# Altium schematic sheet Sch0.SchDoc
size 420 x 297 mm; Address1: Address1; Address2: Address2; Address3: Address3; Address4: Address4; DocumentNumber: ADHF20_DT; SheetNumber: 1; Scale: 1:1; DocumentType: Схема электрическая принципиальная; FirstReferrence: ADHF20_DT
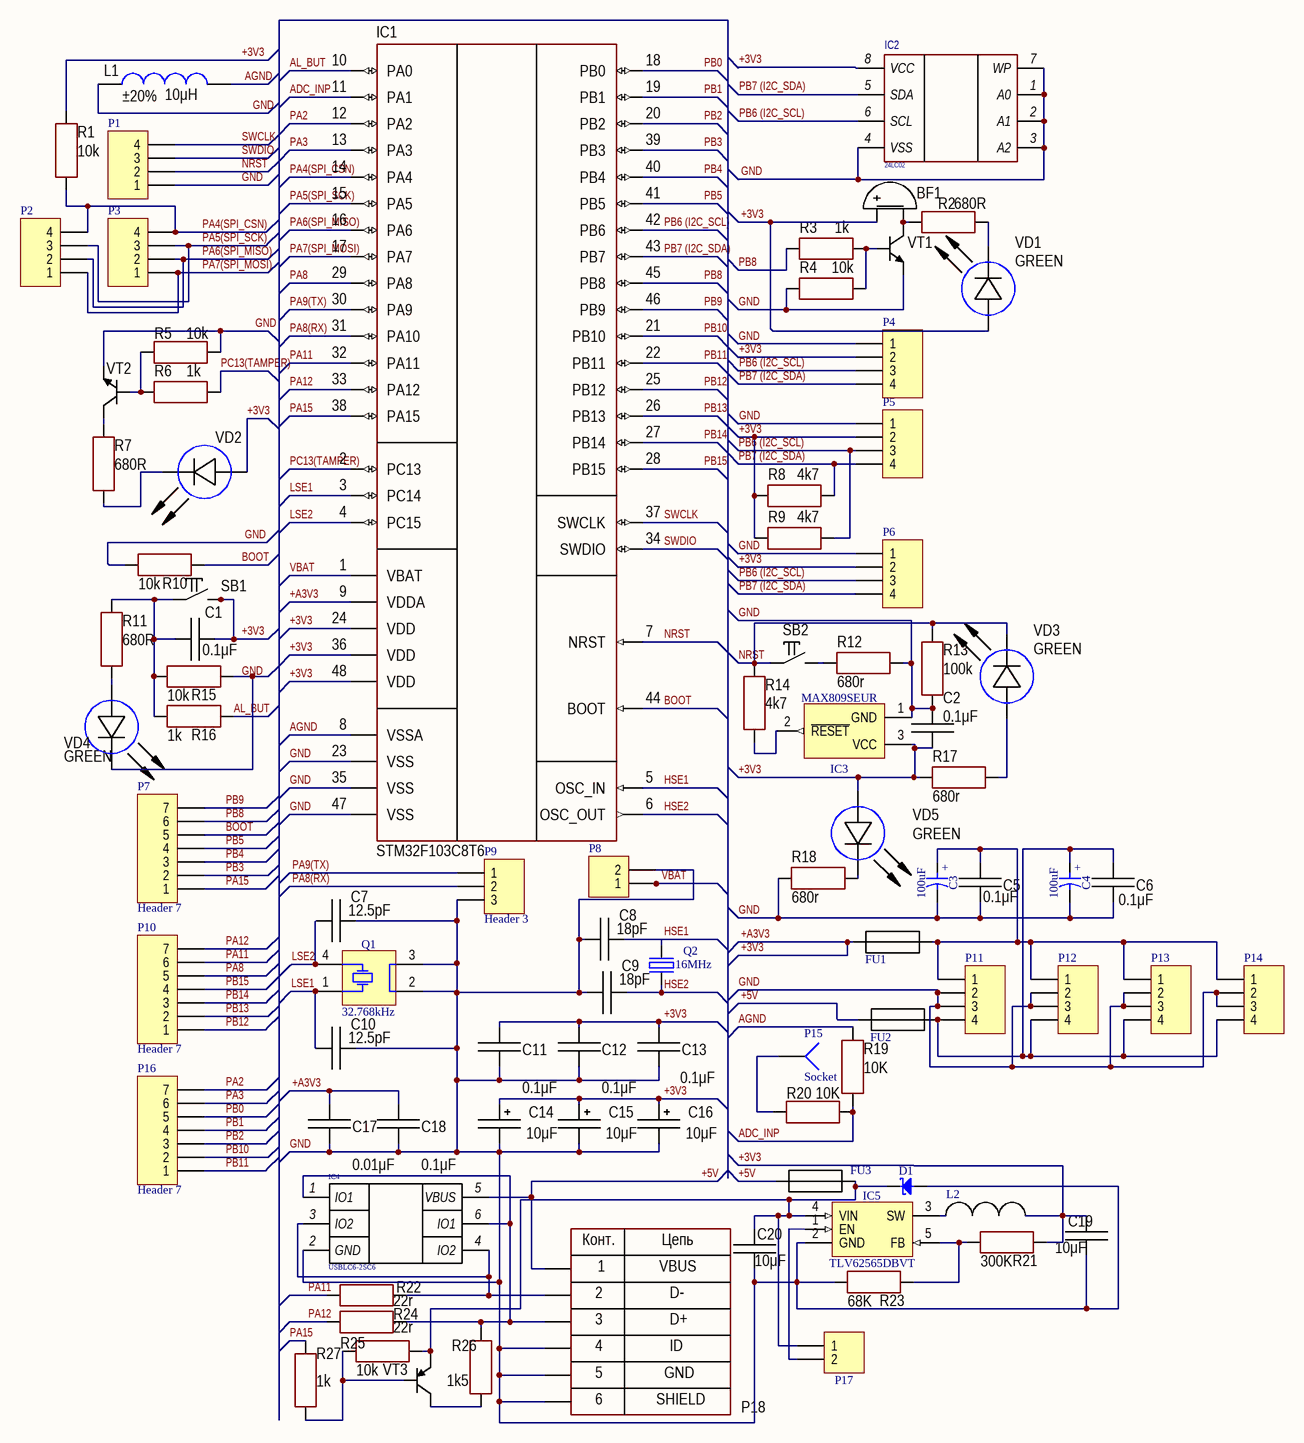
[diagram p0: Sch0.SchDoc]

## Parts
BF1  (no value)  [BUZ: AT-0927-TT-6-R]
C1  value 0.1μF  [CAP: 0603]
C2  value 0.1μF  [CAP: 0603]
C3  100uF  [CAPAE660X540N]
C4  100uF  [CAPAE660X540N]
C5  value 0.1μF  [CAP: 0603]
C6  value 0.1μF  [CAP: 0603]
C7  value 12.5pF  [CAP: 0603]
C8  value 18pF  [CAP: 0603]
C9  value 18pF  [CAP: 0603]
C10  value 12.5pF  [CAP: 0603]
C11  value 0.1μF  [CAP: 0603]
C12  value 0.1μF  [CAP: 0603]
C13  value 0.1μF  [CAP: 0603]
C14  value 10μF  [CAP: TANTAL-A]
C15  value 10μF  [CAP: TANTAL-A]
C16  value 10μF  [CAP: TANTAL-A]
C17  value 0.01μF  [CAP: 0603]
C18  value 0.1μF  [CAP: 0603]
C19  value 10μF  [CAP: 0603]
C20  value 10μF  [CAP: 0603]
D1  SS16  [DIOM5127X229N]  (value not drawn)
FU1  1812L010  [C1812Fuse]  (value not drawn)
FU2  1812L010  [C1812Fuse]  (value not drawn)
FU3  1812L010  [C1812Fuse]  (value not drawn)
IC1  (no value)  [48-LQFP]
IC2  24LC02  [SO-8]
IC3  MAX809SEUR  [SOT95P230X112-3N]
IC4  USBLC6-2SC6  [SOT23-6]
IC5  TLV62565DBVT  [SOT95P280X145-5N]
L1  value 10μH  Tolerance: ±20%  [IND: 0805]
L2  LQH44PN2R2MP0L  [LQH44PP(1515)]  (value not drawn)
P1  Header 4  [HDR1X4]  (value not drawn)
P2  Header 4  [HDR1X4]  (value not drawn)
P3  Header 4  [HDR1X4]  (value not drawn)
P4  Header 4  [HDR1X4]  (value not drawn)
P5  Header 4  [HDR1X4]  (value not drawn)
P6  Header 4  [HDR1X4]  (value not drawn)
P7  Header 7  [HDR1X7]
P8  Header 2  [HDR1X2]  (value not drawn)
P9  Header 3  [HDR1X3]
P10  Header 7  [HDR1X7]
P11  Header 4  [HDR1X4]  (value not drawn)
P12  Header 4  [HDR1X4]  (value not drawn)
P13  Header 4  [HDR1X4]  (value not drawn)
P14  Header 4  [HDR1X4]  (value not drawn)
P15  Socket  [PIN1]
P16  Header 7  [HDR1X7]
P17  Header 2  [HDR1X2]  (value not drawn)
P18  (no value)  [CON: USB micro-A (ZX62-B-5PA)]
Q1  32.768kHz  [XTAL_EPSON_MC-406]
Q2  16MHz  [XTAL1160X490X430]
R1  value 10k  [RES: 0603]
R2  value 680R  [RES: 0603]
R3  value 1k  [RES: 0603]
R4  value 10k  [RES: 0603]
R5  value 10k  [RES: 0603]
R6  value 1k  [RES: 0603]
R7  value 680R  [RES: 0603]
R8  value 4k7  [RES: 0603]
R9  value 4k7  [RES: 0603]
R10  value 10k  [RES: 0603]
R11  value 680R  [RES: 0603]
R12  value 680r  [RES: 0603]
R13  value 100k  [RES: 0603]
R14  value 4k7  [RES: 0603]
R15  value 10k  [RES: 0603]
R16  value 1k  [RES: 0603]
R17  value 680r  [RES: 0603]
R18  value 680r  [RES: 0603]
R19  value 10K  [RES: 0603]
R20  value 10K  [RES: 0603]
R21  value 300K  [RES: 0603]
R22  value 22r  [RES: 0603]
R23  value 68K  [RES: 0603]
R24  value 22r  [RES: 0603]
R25  value 10k  [RES: 0603]
R26  value 1k5  [RES: 0603]
R27  value 1k  [RES: 0603]
SB1  (no value)  [BUT: SKQGADE010]
SB2  (no value)  [BUT: SKQGADE010]
VD1  Color: GREEN  [LED: 0805B]
VD2  (no value)  [LED: 0805B]
VD3  Color: GREEN  [LED: 0805B]
VD4  Color: GREEN  [LED: 0805B]
VD5  Color: GREEN  [LED: 0805B]
VT1  (no value)  [SOT23]
VT2  (no value)  [SOT23]
VT3  (no value)  [SOT23]

## Nets
+3V3: BF1.1(+) C1.2 C2.1 C11.2 C12.2 C13.2 C14.1 C15.1 C16.1 C17.2 C18.2 C19.2 FU1.2 IC1.9(VDDA) IC1.24(VDD) IC1.36(VDD) IC1.48(VDD) IC2.8(VCC) IC3.3(VCC) L2.2 P4.2 P5.2 P6.2 R1.1 R8.2 R9.2 R17.2 R21.1 SB1.2 VD1.1(A) VD2.1(A) VD5.1(A)  [also labelled +A3V3]
+5V: FU2.2 FU3.2 IC4.5(VBUS) P18.1
ADC_INP: IC1.11(PA1) R19.1 R20.1
AGND: IC1.8(VSSA) L1.1 R19.2
AL_BUT: IC1.10(PA0) R16.2
BOOT: IC1.44(BOOT) P7.5 R10.1
GND: C2.2 C3.2 C4.2 C5.1 C6.1 C7.2 C8.1 C9.1 C10.2 C11.1 C12.1 C13.1 C14.2 C15.2 C16.2 C17.1 C18.1 C19.1 C20.1 D1.2(A) IC1.23(VSS) IC1.35(VSS) IC1.47(VSS) IC2.1(A0) IC2.2(A1) IC2.3(A2) IC2.4(VSS) IC2.7(WP) IC3.1(GND) IC4.2(GND) IC5.2(GND) L1.2 P1.1 P4.1 P5.1 P6.1 P8.2 P9.3 P11.2 P11.3 P12.2 P12.3 P13.2 P13.3 P14.2 P14.3 P18.0 P18.4 P18.5 Q1.2(GND) Q1.3(GND) R4.1 R5.1 R10.2 R12.2 R13.2 R18.2 R23.1 VT1.2(E) VT2.2(E)
HSE1: C8.2 IC1.5(OSC_IN) Q2.2(OSC2)
HSE2: C9.2 IC1.6(OSC_OUT) Q2.1(OSC1)
LSE1: C10.1 IC1.3(PC14) Q1.1(X)
LSE2: C7.1 IC1.4(PC15) Q1.4(X)
NRST: IC1.7(NRST) P1.2 R13.1 R14.2 SB2.1 VD3.2(C)
PA2: IC1.12(PA2) P16.7
PA3: IC1.13(PA3) P16.6
PA4(SPI_CSN): IC1.14(PA4) P2.4 P3.4 R1.2
PA5(SPI_SCK): IC1.15(PA5) P2.3 P3.3
PA6(SPI_MISO): IC1.16(PA6) P2.2 P3.2
PA7(SPI_MOSI): IC1.17(PA7) P2.1 P3.1
PA8: IC1.29(PA8) P10.5
PA8(RX): IC1.31(PA10) P9.2
PA9(TX): IC1.30(PA9) P9.1
PA11: IC1.32(PA11) P10.6 R22.1
PA12: IC1.33(PA12) P10.7 R24.1
PA15: IC1.38(PA15) P7.1 R27.1
PB0: IC1.18(PB0) P16.5
PB1: IC1.19(PB1) P16.4
PB2: IC1.20(PB2) P16.3
PB3: IC1.39(PB3) P7.2
PB4: IC1.40(PB4) P7.3
PB5: IC1.41(PB5) P7.4
PB6 (I2C_SCL): IC1.42(PB6) IC2.6(SCL) P4.3 P5.3 P6.3 R9.1
PB7 (I2C_SDA): IC1.43(PB7) IC2.5(SDA) P4.4 P5.4 P6.4 R8.1
PB8: IC1.45(PB8) P7.6 R3.1
PB9: IC1.46(PB9) P7.7
PB10: IC1.21(PB10) P16.2
PB11: IC1.22(PB11) P16.1
PB12: IC1.25(PB12) P10.1
PB13: IC1.26(PB13) P10.2
PB14: IC1.27(PB14) P10.3
PB15: IC1.28(PB15) P10.4
PC13(TAMPER): IC1.2(PC13) R6.1
SWCLK: IC1.37(SWCLK) P1.4
SWDIO: IC1.34(SWDIO) P1.3
VBAT: IC1.1(VBAT) P8.1
NetBF1_2: BF1.2(-) R2.2 VT1.3(C)
NetC1_1: C1.1 R11.1 R15.2 R16.1 SB1.1
NetC3_1: C3.1 C5.2 FU1.1 P11.1 P12.1 P13.1 P14.1
NetC4_1: C4.1 C6.2 FU2.1 P11.4 P12.4 P13.4 P14.4
NetC20_2: C20.2 D1.1(C) FU3.1 IC5.4(VIN) P17.1 R25.1 VT3.2(E)
NetIC3_2: IC3.2(~{RESET}) R14.1
NetIC4_1: IC4.1(IO1) IC4.6(IO1) P18.3 R24.2 R26.1
NetIC4_3: IC4.3(IO2) IC4.4(IO2) P18.2 R22.2
NetIC5_1: IC5.1(EN) P17.2
NetIC5_3: IC5.3(SW) L2.1
NetIC5_5: IC5.5(FB) R21.2 R23.2
NetP15_1: P15.1 R20.2
NetR2_1: R2.1 VD1.2(C)
NetR3_2: R3.2 R4.2 VT1.1(B)
NetR5_2: R5.2 R6.2 VT2.1(B)
NetR7_1: R7.1 VD2.2(C)
NetR7_2: R7.2 VT2.3(C)
NetR11_2: R11.2 VD4.1(A)
NetR12_1: R12.1 SB2.2
NetR15_1: R15.1 VD4.2(C)
NetR17_1: R17.1 VD3.1(A)
NetR18_1: R18.1 VD5.2(C)
NetR25_2: R25.2 R27.2 VT3.1(B)
NetR26_2: R26.2 VT3.3(C)

## Notes on the sheet
- Labels drawn without touching a wire or pin: GND
- Перв. примен.
- Справ. №
- Подп. и дата
- Инв. № дубл.
- Взам. инв. №
- Разраб.
- Изм.
- Лист
- № докум.
- Подп.
- Дата
- Лит.
- Масса
- Масштаб
- Пров.
- Т.контр.
- Листов
- Инв. № подл.
- Утв.
- Н.контр.
- 2.106-A3
- Копировал
- Формат А3
- (in symbol CAE660-540_100UF_16V_20%) +
- (in symbol Connector_USB_micro_B) Конт.; Цепь; VBUS; D-; D+; ID; GND; 6; SHIELD

## Library data of the parts
BF1 = Buzzer: Manufacturer: PUI Audio; ValueManufacturerPartNumber: DIP switch, 2.73 kHz, 3VDC, 80mA, -20...+70°C; PartNumber: AT-0927-TT-6-R; TypeBuzzer: DIP switch; VoltageMax: 3VDC; Frequency: 2.73 kHz; CurrentMax: 80mA; HelpURL: https://www.digikey.com/products/en?keywords=AT-0927-TT-6-R; Temperature: -20...+70°C
C1 C2 C5 C6 C11-C13 C18 = Ceramic_0603: Manufacturer: Yageo; PartNumber: CC0603KRX7R7BB104; ValueManufacturerPartNumber: Ceramic capacitor, 0.1μF, X7R, ±10%, 16V, 0603, -55...+125°C; TypeCapacitor: Ceramic capacitor; Tolerance: ±10%; TypeDielectric: X7R; Voltage: 16V; Package: 0603; HelpURL: https://www.digikey.com/product-detail/en/yageo/CC0603KRX7R7BB104/311-1088-1-ND/302998; Temperature: -55...+125°C
C3 C4 = CAE660-540_100UF_16V_20%: Polarised capacitor; Part Description: Aluminum Electrolytic SMT Capacitor; Manufacturer: PANASONIC; Manufacturer Part Number: EEEFK1C101AP; Voltage: 16V; Tolerance: ±20%; Part Number: CAE660-540_100UF_16V_20%; Component Kind: Standard; Component Type: Standard; Pin Count: 2; Value: 100uF; Status: Not Recommended; Case: D; Mounted: Yes; Socket: No; SMD: Yes; Sense: No; ComponentHeight: 5.8mm; HelpURL: \\cern.ch\dfs\Applications\Altium\Datasheets\CAE_PANASONIC_FK.pdf; Author: CERN DEM JLC; CreateDate: 03.12.2007; LatestRevisionDate: 05.11.2014
C7 C10 = Ceramic_0603: Manufacturer: Yageo; PartNumber: CC0603KRX7R7BB104; ValueManufacturerPartNumber: Ceramic capacitor, 12.5pF, X7R, ±10%, 16V, 0603, -55...+125°C; TypeCapacitor: Ceramic capacitor; Tolerance: ±10%; TypeDielectric: X7R; Voltage: 16V; Package: 0603; HelpURL: https://www.digikey.com/product-detail/en/yageo/CC0603KRX7R7BB104/311-1088-1-ND/302998; Temperature: -55...+125°C
C8 C9 = Ceramic_0603: Manufacturer: Yageo; PartNumber: CC0603KRX7R7BB104; ValueManufacturerPartNumber: Ceramic capacitor, 18pF, X7R, ±10%, 16V, 0603, -55...+125°C; TypeCapacitor: Ceramic capacitor; Tolerance: ±10%; TypeDielectric: X7R; Voltage: 16V; Package: 0603; HelpURL: https://www.digikey.com/product-detail/en/yageo/CC0603KRX7R7BB104/311-1088-1-ND/302998; Temperature: -55...+125°C
C14-C16 = Tantal_A: Manufacturer: Vishay Sprague; PartNumber: 293D106X96R3A2TE3; ValueManufacturerPartNumber: Tantalum capacitor, 10μF, 6.3V, ±10%, 3.4Ohm, case A (3216), -55...+125°C; Impedance: 3.4Ohm; Tolerance: ±10%; TypeDielectric: X7R; TypeCapacitor: Tantalum capacitor; Voltage: 6.3V; Package: case A (3216); HelpURL: https://www.digikey.com/product-detail/en/vishay-sprague/293D106X96R3A2TE3/718-1126-1-ND/1559620; Temperature: -55...+125°C
C17 = Ceramic_0603: Manufacturer: Yageo; PartNumber: CC0603KRX7R7BB104; ValueManufacturerPartNumber: Ceramic capacitor, 0.01μF, X7R, ±10%, 16V, 0603, -55...+125°C; TypeCapacitor: Ceramic capacitor; Tolerance: ±10%; TypeDielectric: X7R; Voltage: 16V; Package: 0603; HelpURL: https://www.digikey.com/product-detail/en/yageo/CC0603KRX7R7BB104/311-1088-1-ND/302998; Temperature: -55...+125°C
C19 C20 = Ceramic_0603: Manufacturer: Yageo; PartNumber: CC0603KRX7R7BB104; ValueManufacturerPartNumber: Ceramic capacitor, 10μF, X7R, ±10%, 16V, 0603, -55...+125°C; TypeCapacitor: Ceramic capacitor; Tolerance: ±10%; TypeDielectric: X7R; Voltage: 16V; Package: 0603; HelpURL: https://www.digikey.com/product-detail/en/yageo/CC0603KRX7R7BB104/311-1088-1-ND/302998; Temperature: -55...+125°C
D1 = SS16: Schottky Diode; Part Description: Surface Mount Schottky Barrier Rectifier; Manufacturer: VISHAY GENERAL SEMICONDUCTOR; Voltage: 60V; Power: 1A; PressFit: No; Bonding: No; Part Number: SS16; Component Kind: Standard; Component Type: Standard; Device: SS16; PackageDescription: DO-214-AC Molded Diode, Body 5.1x2.7mm, IPC Medium Density; Manufacturer Part Number: SS16; Pin Count: 2; Case: DO-214AC; Mounted: Yes; Socket: No; SMD: Yes; Sense: No; ComponentHeight: 2.29mm; HelpURL: \\cern.ch\dfs\Applications\Altium\Datasheets\SS16.pdf; Author: CERN DEM JLC; CreateDate: 15.07.2008; LatestRevisionDate: 23.08.2010
FU1-FU3 = 1812L010: SMD 1812 0,3А 30V; Manufacturer: Littelfuse, Inc.; BOM: 1812L010, 1812 0,3A 30V; Current: 0,3A; Part Number: 1812L010; Package: SMD 1812; Footprint Patch: pcb.pcblib; Voltage: 30V; ComponentLink1URL: https://sds.compel.ru/item-pdf/b89835bf867f48e848cf72775db4e3e5/ps/ltl~polyfusev---1812l.pdf; ComponentLink1Description: Datasheet; Category: FUSE
IC1 = STM32F103C8T6: Cortex-M3; Manufacturer: STMicroelectronics; ValueManufacturerPartNumber: IC microcontroller, 32-Bit, Cortex-M3, 72MHz, 64KB, 20KB, 2...3.6V, -40...+85°C, 48-LQFP; Supply: 2...3.6V; Speed: 72MHz; CoreSize: 32-Bit; MemoryROM: 64KB; MemoryRAM: 20KB; HelpURL: https://www.digikey.com/product-detail/en/stmicroelectronics/STM32F103C8T6TR/497-17666-1-ND/7804402; Package: 48-LQFP; ComponentType: IC microcontroller; Temperature: -40...+85°C; CoreProcessor: Cortex-M3; PartNumber: STM32F103C8T6
IC2 = 24LC02: 2K I2C™ Serial EEPROM; Manufacturer: Microchip Technology Inc; Part Number: 24LC02; Package: SOIC-8; Footprint Patch: ic.PcbLib; BOM: 24LC02; ComponentType: Микросхема; ComponentLink1URL: http://ww1.microchip.com/downloads/en/DeviceDoc/21709c.pdf; ComponentLink1Description: Datasheet; Category: ICs
IC3 = MAX809MEUR: 3-Pin Microprocessor Reset Circuit; Part Description: 3-Pin Microprocessor Reset Circuit (Reset Threshold 4.38V); Manufacturer: MAXIM; PressFit: No; Bonding: No; Part Number: MAX809SEUR; Component Kind: Standard; Component Type: Standard; Device: MAX809SEUR; PackageDescription: SOT23 3-Leads, Pitch 0.95mm - Body 1.3x2.86mm, IPC Medium Density; Manufacturer Part Number: MAX809SEUR; Pin Count: 3; Case: SOT23; Mounted: Yes; Socket: No; SMD: Yes; Sense: No; ComponentHeight: 1.12mm; HelpURL: \\cern.ch\dfs\Applications\Altium\Datasheets\MAX809MEUR.pdf; Author: CERN DEM JLC; CreateDate: 23.08.2012; LatestRevisionDate: 23.08.2012
IC4 = USBLC6-2SC6: Very low capacitance ESD protection USBLC6-2SC6; Manufacturer: STMicroelectronics; Part Number: USBLC6-2SC6; Package: SOT23-6; Footprint Patch: ic.PcbLib; BOM: USBLC6-2SC6; ComponentType: Микросхема; ComponentLink1URL: http://www.st.com/web/en/resource/technical/document/datasheet/CD00050750.pdf; ComponentLink1Description: Datasheet; Category: ICs
IC5 = TLV62565DBVT: 1.5A High Efficiency Step-Down Converter, Adjustable Output Voltage; Manufacturer: TEXAS INSTRUMENTS; PressFit: No; Bonding: No; Part Number: TLV62565DBVT; Component Kind: Standard; Component Type: Standard; Device: TLV62565DBVT; PackageDescription: SOT, 0.95mm Pitch; 5 Pin, 1.60mm W X 2.90mm L X 1.45mm H Body, IPC Medium Density; Part Description: 1.5A High Efficiency Step-Down Converter, Adjustable Output Voltage; Manufacturer Part Number: TLV62565DBVT; Pin Count: 5; Case: SOT23-5; Mounted: Yes; Socket: No; SMD: Yes; Sense: No; ComponentHeight: 1.45mm; HelpURL: \\cern.ch\dfs\Applications\Altium\Datasheets\TLV62565DBVT.pdf; Author: CERN DEM JMW; CreateDate: 29.08.2016; LatestRevisionDate: 29.08.2016
L1 = Inductor_0805: Manufacturer: Murata Electronics; PartNumber: LQM21FN100M70L; ValueManufacturerPartNumber: Fixed inductor, 10μH, ±20%, 0805, 100mA, -55...+125°C; TypeInductor: Fixed inductor; MaxCurrent: 100mA; Package: 0805; HelpURL: https://www.digikey.com/product-detail/en/murata-electronics-north-america/LQM21FN100M70L/490-4029-1-ND/1016289; Temperature: -55...+125°C
L2 = LQH44PN2R2MP0L: Manufacturer: MURATA; BOM: LQH44PN2R2MP0L, 2,2uH; Value: 2,2uH; Current: 1800; Part Number: LQH44PN2R2MP0L; Footprint Patch: transform.PcbLib; ComponentLink1URL: http://www.mouser.com/catalog/catalogusd/645/1188.pdf; ComponentLink1Description: Datasheet; Category: L
P1-P6 P11-P14 = Header 4: Header, 4-Pin; LatestRevisionDate: 17-Jul-2002; LatestRevisionNote: Re-released for DXP Platform.; Publisher: Altium Limited
P7 P10 P16 = Header 7: Header, 7-Pin; LatestRevisionDate: 17-Jul-2002; LatestRevisionNote: Re-released for DXP Platform.; Publisher: Altium Limited
P8 P17 = Header 2: Header, 2-Pin; LatestRevisionDate: 17-Jul-2002; LatestRevisionNote: Re-released for DXP Platform.; Publisher: Altium Limited
P9 = Header 3: Header, 3-Pin; LatestRevisionDate: 17-Jul-2002; LatestRevisionNote: Re-released for DXP Platform.; Publisher: Altium Limited
P18 = Connector_USB_micro_B: Manufacturer: Hirose Electric; ValueManufacturerPartNumber: USB micro B; PartNumber: ZX62-B-5PA; HelpURL: https://www.digikey.com/product-detail/en/hirose-electric-co-ltd/ZX62-B-5PA/H11579CT-ND/1851090; TypeConnector: USB micro B
Q1 = XTAL_32.768KHZ_EPSON_MC-406 32.768K-A3:ROHS: Crystal 4 pins 1=XTAL Control 2 And 3=NC 4=XTAL; Part Description: Load capacitance 12.5pF, Frequency Tolerance ±20 ppm, 40°C to 85°C, Surface Mount Quartz Crystal, MC-406 Series; Manufacturer: EPSON TOYOCOM; PressFit: No; Bonding: No; Part Number: XTAL_32.768KHZ_EPSON_MC-406 32.768K-A3:ROHS; Component Kind: Standard; Component Type: Standard; PackageDescription: EPSON Crystal; 10.41mm L X 4.06mm W X 3.6mm H; Value: 32.768kHz; Manufacturer Part Number: MC-406 32.768K-A3:ROHS; Pin Count: 4; Mounted: Yes; Socket: No; SMD: Yes; Sense: No; ComponentHeight: 3.6mm; HelpURL: \\cern.ch\dfs\Applications\Altium\Datasheets\XTAL_EPSON_MC-406.pdf; ComponentLink1URL: \\cern.ch\dfs\Applications\Altium\Datasheets\XTAL_EPSON_MC-406_Ordering-Informations.pdf; ComponentLink1Description: Ordering Informations; Author: CERN DEM JLC; CreateDate: 27.03.2012; LatestRevisionDate: 30.01.2013
Q2 = XTAL_16MHZ_IQD_LFXTAL003237: Quartz Crystal; Part Description: Tolerance: ± 30ppm, Stability: ± 50ppm, -10°C to +60°C, 16pF, Surface Mount Quartz Crystal, HC49/4HSMX Series; Manufacturer: IQD FREQUENCY PRODUCTS; PressFit: No; Bonding: No; Part Number: XTAL_16MHZ_IQD_LFXTAL003237; Component Kind: Standard; Component Type: Standard; PackageDescription: HC49/4H SMX Case, SMD Cristal, Body 11.6x4.9mm; Value: 16MHz; Manufacturer Part Number: LF XTAL003237; Pin Count: 2; Mounted: Yes; Socket: No; SMD: Yes; Sense: No; ComponentHeight: 4.3mm; HelpURL: \\cern.ch\dfs\Applications\Altium\Datasheets\XTAL_IQD_LFXTAL003237.pdf; Author: CERN DEM MR; CreateDate: 23.03.2016; LatestRevisionDate: 07.11.2016
R1 R4 R5 R10 R15 R25 = Resistor_0603: Manufacturer: Yageo; PartNumber: RC0603JR-07100RL; ValueManufacturerPartNumber: Resistor film, 10k, ±5%, 0603, 0.1W, -55...+125°C; TypeResistor: Resistor film; Power: 0.1W; Tolerance: ±5%; Package: 0603; HelpURL: https://www.digikey.com/product-detail/en/yageo/RC0603JR-07100RL/311-100GRCT-ND/729644; Temperature: -55...+125°C
R2 R7 R11 = Resistor_0603: Manufacturer: Yageo; PartNumber: RC0603JR-07100RL; ValueManufacturerPartNumber: Resistor film, 680R, ±5%, 0603, 0.1W, -55...+125°C; TypeResistor: Resistor film; Power: 0.1W; Tolerance: ±5%; Package: 0603; HelpURL: https://www.digikey.com/product-detail/en/yageo/RC0603JR-07100RL/311-100GRCT-ND/729644; Temperature: -55...+125°C
R3 R6 R16 R27 = Resistor_0603: Manufacturer: Yageo; PartNumber: RC0603JR-07100RL; ValueManufacturerPartNumber: Resistor film, 1k, ±5%, 0603, 0.1W, -55...+125°C; TypeResistor: Resistor film; Power: 0.1W; Tolerance: ±5%; Package: 0603; HelpURL: https://www.digikey.com/product-detail/en/yageo/RC0603JR-07100RL/311-100GRCT-ND/729644; Temperature: -55...+125°C
R8 R9 R14 = Resistor_0603: Manufacturer: Yageo; PartNumber: RC0603JR-07100RL; ValueManufacturerPartNumber: Resistor film, 4k7, ±5%, 0603, 0.1W, -55...+125°C; TypeResistor: Resistor film; Power: 0.1W; Tolerance: ±5%; Package: 0603; HelpURL: https://www.digikey.com/product-detail/en/yageo/RC0603JR-07100RL/311-100GRCT-ND/729644; Temperature: -55...+125°C
R12 R17 R18 = Resistor_0603: Manufacturer: Yageo; PartNumber: RC0603JR-07100RL; ValueManufacturerPartNumber: Resistor film, 680r, ±5%, 0603, 0.1W, -55...+125°C; TypeResistor: Resistor film; Power: 0.1W; Tolerance: ±5%; Package: 0603; HelpURL: https://www.digikey.com/product-detail/en/yageo/RC0603JR-07100RL/311-100GRCT-ND/729644; Temperature: -55...+125°C
R13 = Resistor_0603: Manufacturer: Yageo; PartNumber: RC0603JR-07100RL; ValueManufacturerPartNumber: Resistor film, 100k, ±5%, 0603, 0.1W, -55...+125°C; TypeResistor: Resistor film; Power: 0.1W; Tolerance: ±5%; Package: 0603; HelpURL: https://www.digikey.com/product-detail/en/yageo/RC0603JR-07100RL/311-100GRCT-ND/729644; Temperature: -55...+125°C
R19 R20 = Resistor_0603: Manufacturer: Yageo; PartNumber: RC0603JR-07100RL; ValueManufacturerPartNumber: Resistor film, 10K, ±5%, 0603, 0.1W, -55...+125°C; TypeResistor: Resistor film; Power: 0.1W; Tolerance: ±5%; Package: 0603; HelpURL: https://www.digikey.com/product-detail/en/yageo/RC0603JR-07100RL/311-100GRCT-ND/729644; Temperature: -55...+125°C
R21 = Resistor_0603: Manufacturer: Yageo; PartNumber: RC0603JR-07100RL; ValueManufacturerPartNumber: Resistor film, 300K, ±5%, 0603, 0.1W, -55...+125°C; TypeResistor: Resistor film; Power: 0.1W; Tolerance: ±5%; Package: 0603; HelpURL: https://www.digikey.com/product-detail/en/yageo/RC0603JR-07100RL/311-100GRCT-ND/729644; Temperature: -55...+125°C
R22 R24 = Resistor_0603: Manufacturer: Yageo; PartNumber: RC0603JR-07100RL; ValueManufacturerPartNumber: Resistor film, 22r, ±5%, 0603, 0.1W, -55...+125°C; TypeResistor: Resistor film; Power: 0.1W; Tolerance: ±5%; Package: 0603; HelpURL: https://www.digikey.com/product-detail/en/yageo/RC0603JR-07100RL/311-100GRCT-ND/729644; Temperature: -55...+125°C
R23 = Resistor_0603: Manufacturer: Yageo; PartNumber: RC0603JR-07100RL; ValueManufacturerPartNumber: Resistor film, 68K, ±5%, 0603, 0.1W, -55...+125°C; TypeResistor: Resistor film; Power: 0.1W; Tolerance: ±5%; Package: 0603; HelpURL: https://www.digikey.com/product-detail/en/yageo/RC0603JR-07100RL/311-100GRCT-ND/729644; Temperature: -55...+125°C
R26 = Resistor_0603: Manufacturer: Yageo; PartNumber: RC0603JR-07100RL; ValueManufacturerPartNumber: Resistor film, 1k5, ±5%, 0603, 0.1W, -55...+125°C; TypeResistor: Resistor film; Power: 0.1W; Tolerance: ±5%; Package: 0603; HelpURL: https://www.digikey.com/product-detail/en/yageo/RC0603JR-07100RL/311-100GRCT-ND/729644; Temperature: -55...+125°C
SB1 SB2 = Button_tactile: Manufacturer: TE Connectivity; ValueManufacturerPartNumber: Tactile button, 6x6mm; PartNumber: FSM2JSMAATR; TypeButton: Tactile button; HelpURL: https://www.digikey.com/product-detail/en/te-connectivity-alcoswitch-switches/FSM2JSMAATR/450-1792-1-ND/3503931; Package: 6x6mm
VD1 VD3-VD5 = LED_single: ValueManufacturerPartNumber: LED, Green, *, *, *, -55...+150°C; TypeDiode: LED; Manufacturer: *; Package: *; HelpURL: *; Temperature: -55...+150°C; Current: *; VoltageDrop: *; PartNumber: *; ColorParameter: Green
VD2 = LED_single: ValueManufacturerPartNumber: LED, Green, *, *, *, -55...+150°C; TypeDiode: LED; ColorParameter: Green; Manufacturer: *; Package: *; HelpURL: *; Temperature: -55...+150°C; Current: *; VoltageDrop: *; PartNumber: *
VT1 VT2 = BJT_NPN_132: Manufacturer: ON Semiconductor; ValueManufacturerPartNumber: NPN transistor, 45V, 100mA, 100MHz, 300mW, 0.6V, 420, SOT-23, -55...+125°C; PartNumber: BC847CLT1G; TypeTransistor: NPN transistor; VoltageCE: 45V; CurrentCE: 100mA; VoltageSaturation: 0.6V; Frequency: 100MHz; CurrentGain: 420; MaxPower: 300mW; Package: SOT-23; HelpURL: https://www.digikey.com/product-detail/en/on-semiconductor/BC847CLT1G/BC847CLT1GOSCT-ND/917836; Temperature: -55...+125°C
VT3 = BJT_PNP_123: Manufacturer: ON Semiconductor; ValueManufacturerPartNumber: PNP transistor, 45V, 100mA, 100MHz, 300mW, 0.65V, 220, SOT-23, -55...+125°C; PartNumber: BC857BLT3G; TypeTransistor: PNP transistor; VoltageCE: 45V; CurrentCE: 100mA; VoltageSaturation: 0.65V; Frequency: 100MHz; CurrentGain: 220; MaxPower: 300mW; Package: SOT-23; HelpURL: https://www.digikey.com/product-detail/en/on-semiconductor/BC857BLT3G/BC857BLT3GOSCT-ND/2704963; Temperature: -55...+125°C
P15 = Socket: LatestRevisionDate: 17-Jul-2002; LatestRevisionNote: Re-released for DXP Platform.; Publisher: Altium Limited